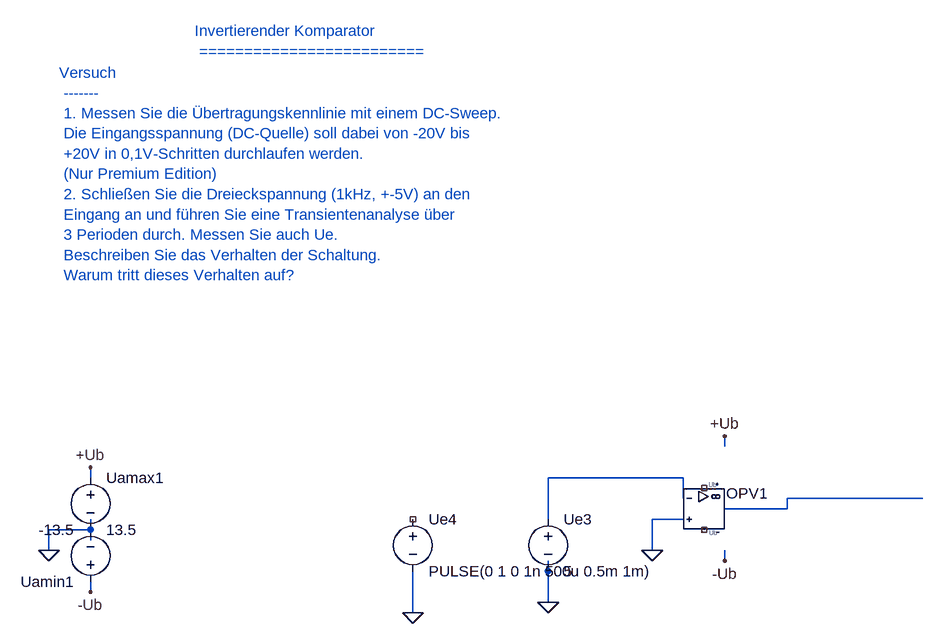
[diagram p0: schematic 1_1_2_Invertierender Komparator (1).asc]
1_1_2_Invertierender Komparator (1).asc, the LTspice schematic file:
Version 4
SHEET 1 880 680
WIRE 1072 800 1072 768
WIRE 1136 816 1232 816
WIRE 1232 816 1232 800
WIRE 160 848 160 832
WIRE 160 848 160 864
WIRE 864 912 864 896
WIRE 656 912 656 928
WIRE 160 768 160 752
WIRE 1136 704 1136 720
WIRE 1136 896 1136 880
WIRE 1024 880 1024 832
WIRE 1024 832 1072 832
WIRE 1440 800 1232 800
WIRE 864 896 864 960
WIRE 656 928 656 976
WIRE 160 848 96 848
WIRE 96 848 96 880
WIRE 160 928 160 944
WIRE 1072 768 864 768
WIRE 864 768 864 832
FLAG 1024 880 0
FLAG 864 960 0
FLAG 96 880 0
FLAG 656 976 0
FLAG 96 880 0
FLAG 1024 880 0
FLAG 864 960 0
FLAG 656 976 0
FLAG 160 752 +Ub
FLAG 1136 704 +Ub
FLAG 160 944 -Ub
FLAG 1136 896 -Ub
SYMBOL UniversalOpAmp2 1104 816 R0
SYMATTR InstName OPV1
SYMATTR Value UniversalOpAmp2
SYMBOL voltage 160 752 R0
SYMATTR InstName Uamax1
SYMATTR Value 13.5
SYMBOL voltage 160 944 R180
SYMATTR InstName Uamin1
SYMATTR Value -13.5
SYMBOL voltage 864 816 R0
SYMATTR InstName Ue3
SYMATTR Value 5
SYMBOL voltage 656 816 R0
SYMATTR InstName Ue4
SYMATTR Value PULSE(0 1 0 1n 500u 0.5m 1m)
TEXT 320 80 Left 2 ;Invertierender Komparator \n =========================
TEXT 112 144 Left 2 ;Versuch \n ------- \n 1. Messen Sie die Übertragungskennlinie mit einem DC-Sweep. \n Die Eingangsspannung (DC-Quelle) soll dabei von -20V bis \n +20V in 0,1V-Schritten durchlaufen werden. \n (Nur Premium Edition) \n 2. Schließen Sie die Dreieckspannung (1kHz, +-5V) an den \n Eingang an und führen Sie eine Transientenanalyse über \n 3 Perioden durch. Messen Sie auch Ue. \n Beschreiben Sie das Verhalten der Schaltung. \n Warum tritt dieses Verhalten auf?

The netlist it stands for:
* 1_1_2_Invertierender Komparator (1).asc
XOPV1 0 N001 NC_01 NC_02 N002 level2 UniversalOpAmp2 Avol=1Meg GBW=10Meg Slew=10Meg Ilimit=25m Rail=0 Vos=0 En=0 Enk=0 In=0 Ink=0 Rin=500Meg  ; pins In+ In- V+ V- OUT
V§Uamax1 +Ub 0 13.5
V§Uamin1 -Ub 0 -13.5
V§Ue3 N001 0 5
V§Ue4 NC_03 0 PULSE(0 1 0 1n 500u 0.5m 1m)
* Invertierender Komparator
*  =========================
* Versuch
*  -------
*  1. Messen Sie die Übertragungskennlinie mit einem DC-Sweep.
*  Die Eingangsspannung (DC-Quelle) soll dabei von -20V bis
*  +20V in 0,1V-Schritten durchlaufen werden.
*  (Nur Premium Edition)
*  2. Schließen Sie die Dreieckspannung (1kHz, +-5V) an den
*  Eingang an und führen Sie eine Transientenanalyse über
*  3 Perioden durch. Messen Sie auch Ue.
*  Beschreiben Sie das Verhalten der Schaltung.
*  Warum tritt dieses Verhalten auf?
.lib UniversalOpAmp2.lib
.backanno
.end